# EAGLE design monitor-one-proto-card-v0.0.2 (EAGLE 9.6.2)
Assembly variants: proto-click
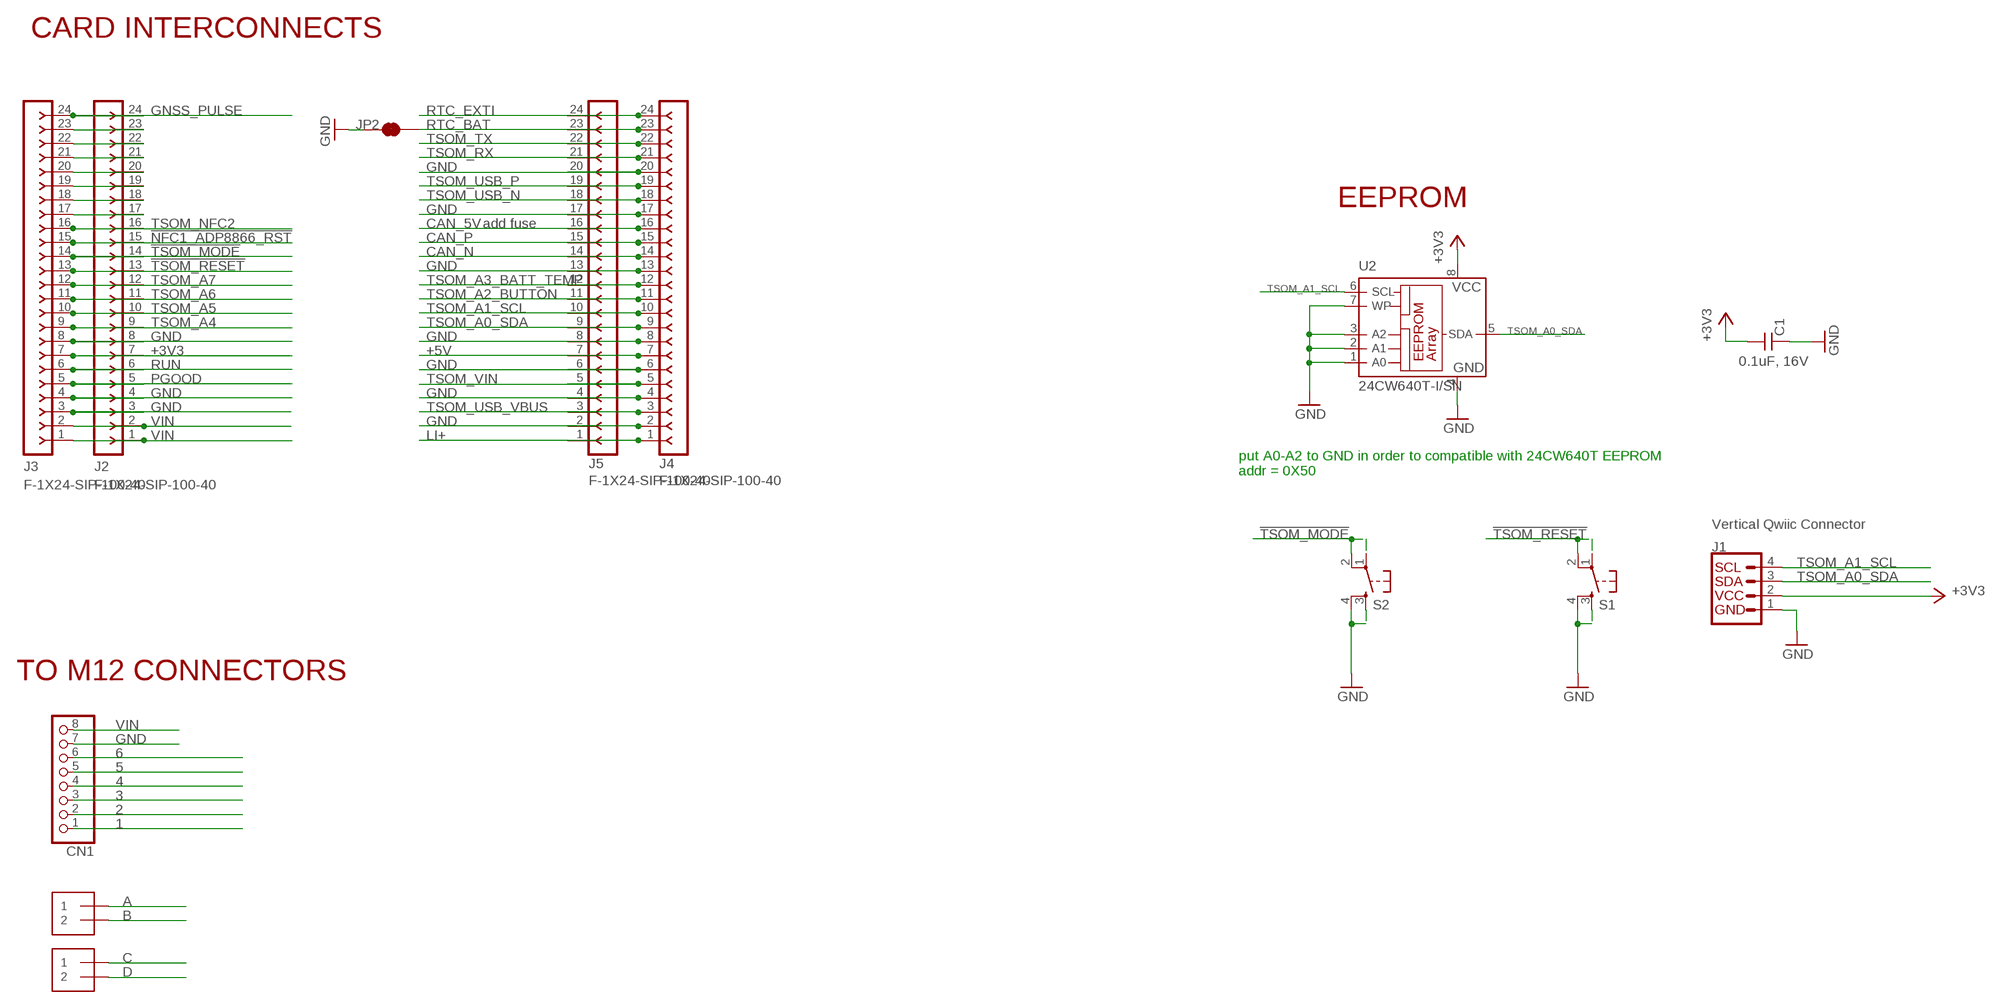
[diagram p0: schematic, sheet 1]

## Parts
C1  0.1uF, 16V  CAP_0.1UF_16V_0603  [C0603_P]  (not fitted in variant proto-click)
CN1  JST_8PIN  [JSTPH8]
J1  Vertical Qwiic Connector  QWIIC_CONNECTOR  [JST04_1MM_VERT]
J2  F-1X24-SIP-100-40  [SIP-100-24-40]
J3  F-1X24-SIP-100-40  [SIP-100-24-40]
J4  F-1X24-SIP-100-40  [SIP-100-24-40]
J5  F-1X24-SIP-100-40  [SIP-100-24-40]
J8  1X2-3.5MM  [1X2-3.5MM]
J9  1X2-3.5MM  [1X2-3.5MM]
JP2  JUMPER-SMT_2_NC_TRACE_NO-SILK  [SMT-JUMPER_2_NC_TRACE_NO-SILK]
S1  TAC_SWITCHSMD  [TACTILE_SWITCH_SMD]
S2  TAC_SWITCHSMD  [TACTILE_SWITCH_SMD]
U2  24CW640T-I/SN  24AA01SN  [SO-08]  (not fitted in variant proto-click)

## Nets
1: CN1.1
2: CN1.2
3: CN1.3
4: CN1.4
5: CN1.5
6: CN1.6
!NFC1_ADP8866_RST: J2.15 J3.15
!TSOM_MODE: J2.14 J3.14 S2.1 S2.2
!TSOM_RESET: J2.13 J3.13 S1.1 S1.2
+3V3: C1.1 J1.2 J2.7 J3.7 U2.8(VCC)
+5V: J4.7 J5.7
A: J8.1
B: J8.2
C: J9.1
CAN_5V: J4.16 J5.16
CAN_N: J4.14 J5.14
CAN_P: J4.15 J5.15
D: J9.2
GND: C1.2 CN1.7 J1.1 J2.3 J2.4 J2.8 J3.3 J3.4 J3.8 J4.2 J4.4 J4.6 J4.8 J4.13 J4.17 J4.20 J5.2 J5.4 J5.6 J5.8 J5.13 J5.17 J5.20 JP2.1 S1.3 S1.4 S2.3 S2.4 U2.1(A0) U2.2(A1) U2.3(A2) U2.4(GND) U2.7(WP)
GNSS_PULSE: J2.24 J3.24
LI+: J4.1 J5.1
N$3: J2.17 J3.17
N$4: J2.18 J3.18
N$5: J2.19 J3.19
N$6: J2.20 J3.20
N$7: J2.21 J3.21
N$8: J2.22 J3.22
N$9: J2.23 J3.23
PGOOD: J2.5 J3.5
RTC_BAT: J4.23 J5.23 JP2.2
RTC_EXTI: J4.24 J5.24
RUN: J2.6 J3.6
TSOM_A0_SDA: J1.3 J4.9 J5.9 U2.5(SDA)
TSOM_A1_SCL: J1.4 J4.10 J5.10 U2.6(SCL)
TSOM_A2_BUTTON: J4.11 J5.11
TSOM_A3_BATT_TEMP: J4.12 J5.12
TSOM_A4: J2.9 J3.9
TSOM_A5: J2.10 J3.10
TSOM_A6: J2.11 J3.11
TSOM_A7: J2.12 J3.12
TSOM_NFC2: J2.16 J3.16
TSOM_RX: J4.21 J5.21
TSOM_TX: J4.22 J5.22
TSOM_USB_N: J4.18 J5.18
TSOM_USB_P: J4.19 J5.19
TSOM_USB_VBUS: J4.3 J5.3
TSOM_VIN: J4.5 J5.5
VIN: CN1.8 J2.1 J2.2 J3.1 J3.2

## Notes on the sheet
- CARD INTERCONNECTS
- EEPROM
- add fuse
- put A0-A2 to GND in order to compatible with 24CW640T EEPROM
  addr = 0X50
- TO M12 CONNECTORS

## Library data of the parts
C1 = particle-studios:CAP_: Particle Capacitors; DESP: CAP CER 0.1UF 16V X7R 0603; MFG: FENGHUA; MPN: 0603B104K160NT; PPN: PT-200082
CN1 = microbuilder:JST_8PIN: JST 8-Pin Right-Angle Connector
J1 = SparkFun-Connectors:QWIIC_CONNECTOR: SparkFun I2C Standard Qwiic Connector An SMD 1mm pitch JST connector makes it easy and quick (get it? Qwiic?) to connect I2C devices to each other. The Qwiic system <http://www.sparkfun.com/qwiic> enables fast and solderless connection between popular platforms and various sensors and actuators. We carry 200mm <https://www.sparkfun.com/products/14204>, 100mm <https://www.sparkfun.com/products/14205>, 50mm <https://www.sparkfun.com/products/14206>, and breadboard friendly <https://www.sparkfun.com/products/14207> Qwiic cables. We also offer 10 pcs strips <https://www.sparkfun.com/products/14323> the SMD connectors.; PROD_ID: CONN-14483
J2-J5 = con-headers-jp:F-1X24-: FEMALE HEADER
J8 J9 = adafruit:1X2: 3.5mm Terminal block http://www.ladyada.net/library/pcb/eaglelibrary.html
JP2 = SparkFun-Jumpers:JUMPER-SMT_2_NC_TRACE: Normally closed trace jumper This jumper has a trace between two pads so it's normally closed (NC). Use a razor knife to open the connection. For best results follow the IPC guidelines for cutting traces: Cutout at least 0.063 mm (0.005 in). Remove all loose material to clean up the cut area. Seal the cut with an approved epoxy. Reapply solder to reclose the connection.
S1 S2 = particle-studios:TAC_SWITCH: SMD Tactiile Switch
U2 = microchip:24*: Serial EEPROM I2C; MF: MICROCHIP; MPN: 24AA01/SN; OC_FARNELL: 1331268; OC_NEWARK: 89C9792

## Net classes
1 USB: width 0.483 mm, clearance 0.152 mm
3 CAN: width 0.483 mm, clearance 0.152 mm

## Board
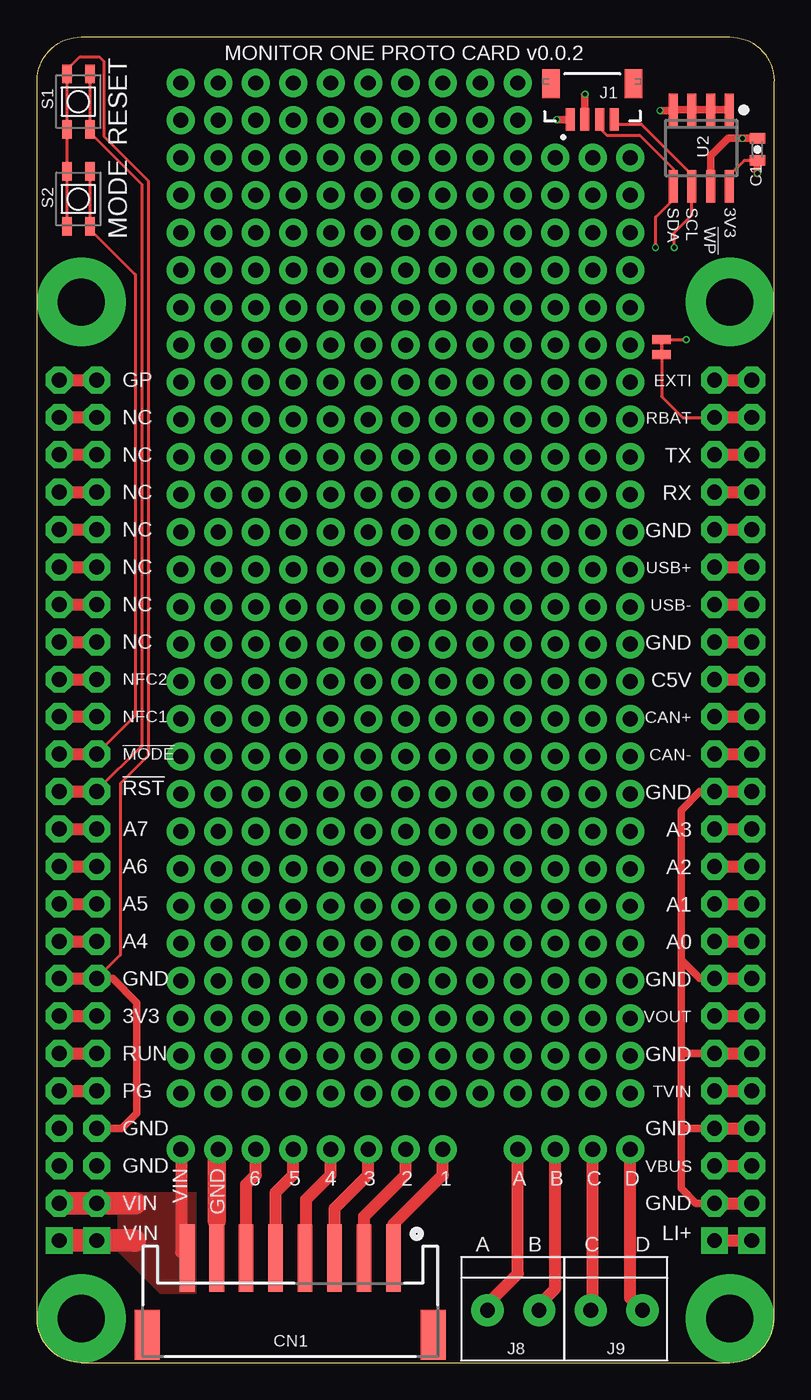
[diagram p1: board, top side]
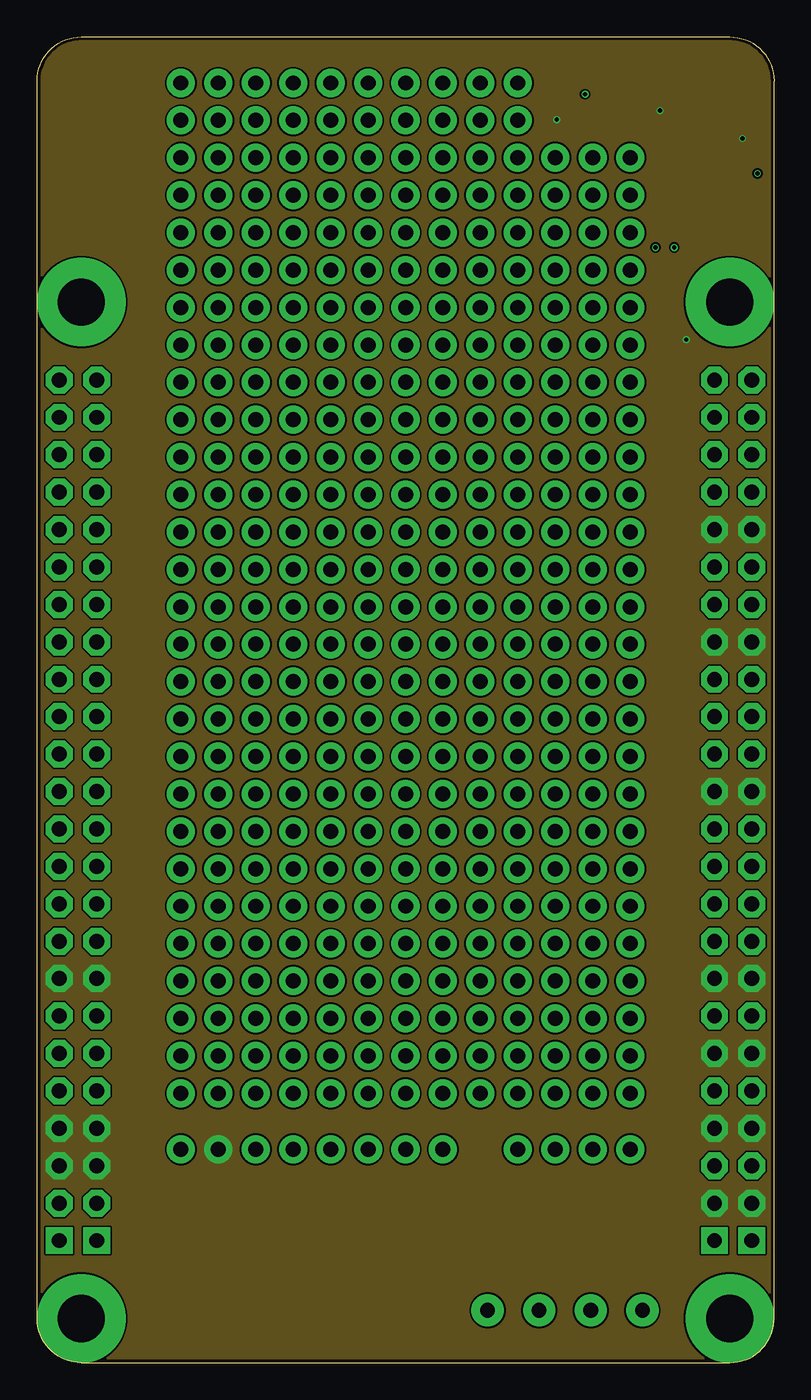
[diagram p2: board, inner layer Route2]
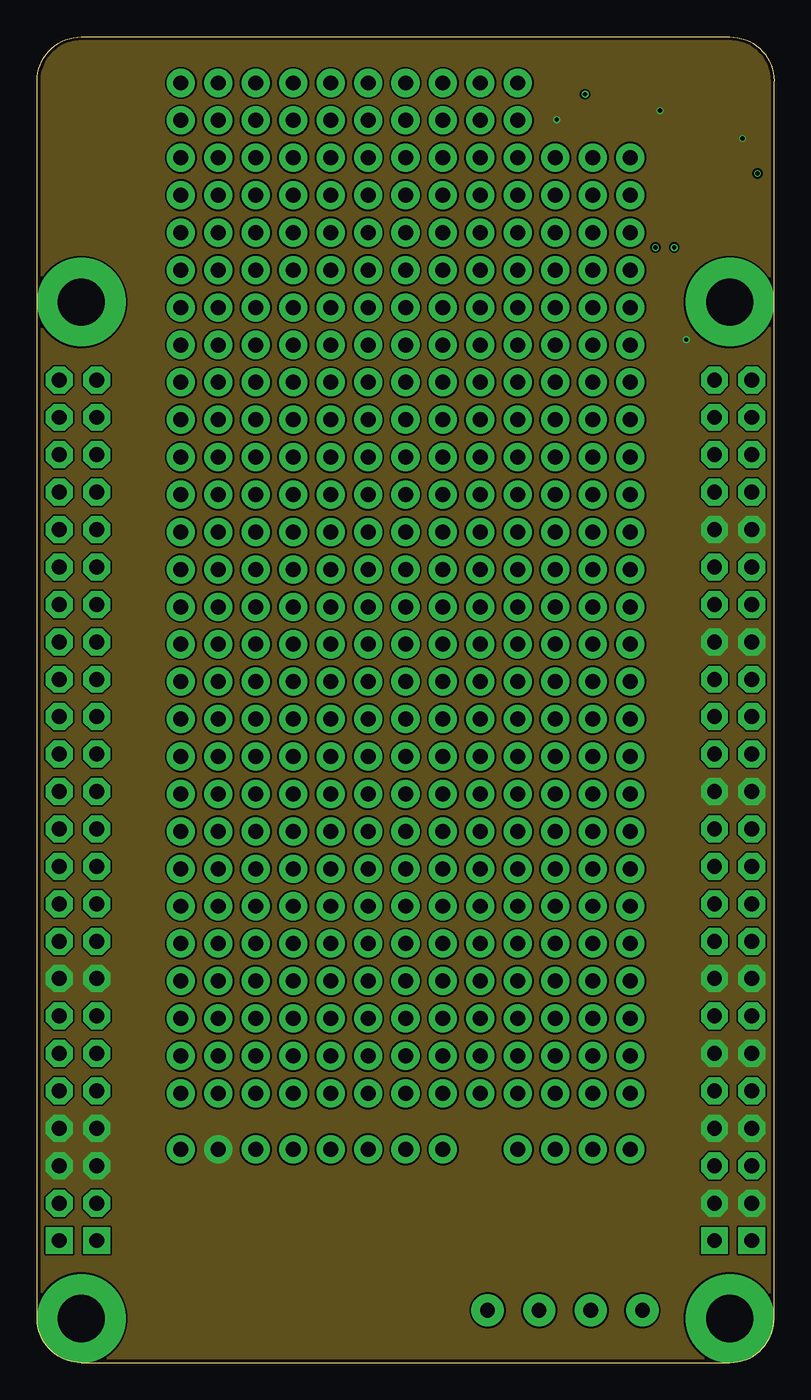
[diagram p3: board, inner layer Route15]
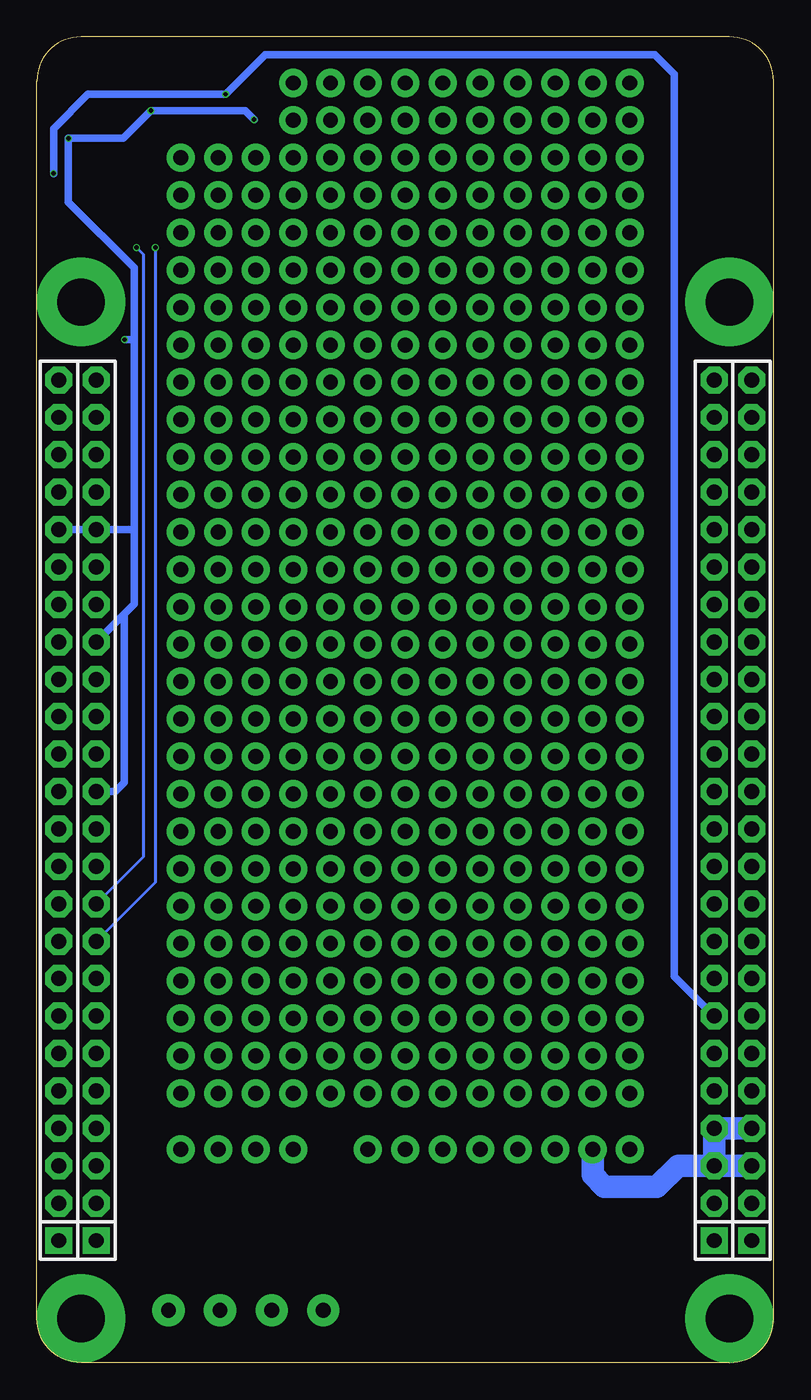
[diagram p4: board, bottom side, seen from below]

Size 50 x 90 mm. Coordinates in mm from the lower left corner, seen from the top.
Outline: 3,0 47,0 arc90 50,3 50,87 arc90 47,90 3,90 arc90 0,87 0,3 arc90 3,0
Copper layers (1*16): Top 0.035mm / dielectric 1.6mm / Bottom 0.035mm
Design rules "jlcpcb-2layers": minimum track width 5mil, minimum drill 0.3mm, track to track 5mil, track to pad 5mil, pad to pad 5mil, via to via 5mil, smd to smd 5mil, copper to edge 0.2mm, drill to drill 6mil, minimum pad ring 10mil, minimum via ring 3mil, stop-mask expansion 4mil, vias tented up to drill 0mil, thermal gap 10mil

### Footprints (pad centres in the part's own frame; a part is rotated, then mirrored left to right if it is on the bottom)
C0603_P = smd 0.711 x 1.041: 1 -0.749,0; 2 0.749,0
JSTPH8 = smd 1 x 4.6: 1 -7,-3.7; 2 -5,-3.7; 3 -3,-3.7; 4 -1,-3.7; 5 1,-3.7; 6 3,-3.7; 7 5,-3.7; 8 7,-3.7 | smd 1.7 x 3.4: NC1 -9.7,1.5; NC2 9.7,1.5
JST04_1MM_VERT = smd 0.6 x 1.55: 1 -1.478,0.775; 2 -0.478,0.775; 3 0.522,0.775; 4 1.522,0.775 | smd 1.2 x 2: NC1 -2.778,3.2; NC2 2.822,3.2
SIP-100-24-40 = drill 1.016 pad 1.778 square: 1 -29.21,0 | drill 1.016 pad 1.778 octagon: 2 -26.67,0; 3 -24.13,0; 4 -21.59,0; 5 -19.05,0; 6 -16.51,0; 7 -13.97,0; 8 -11.43,0; 9 -8.89,0; 10 -6.35,0; 11 -3.81,0; 12 -1.27,0; 13 1.27,0; 14 3.81,0; 15 6.35,0; 16 8.89,0; 17 11.43,0; 18 13.97,0; 19 16.51,0; 20 19.05,0; 21 21.59,0; 22 24.13,0; 23 26.67,0; 24 29.21,0
1X2-3.5MM = drill 1 pad 2.184: 1 1.8,0; 2 -1.7,0
SMT-JUMPER_2_NC_TRACE_NO-SILK = smd 0.635 x 1.27: 1 -0.508,0; 2 0.508,0
TACTILE_SWITCH_SMD = smd 1.25 x 0.65: 1 -1.875,0.775; 2 1.875,0.775; 3 -1.875,-0.775; 4 1.875,-0.775
SO-08 = smd 0.6 x 2.2: 1 -1.905,-2.6; 2 -0.635,-2.6; 3 0.635,-2.6; 4 1.905,-2.6; 5 1.905,2.6; 6 0.635,2.6; 7 -0.635,2.6; 8 -1.905,2.6

### Placement (x,y rotation side)
C1  48.87,82.35 90 top
CN1  17.18,3.4 180 top
J1  37.64,83.62 0 top
J2  1.5,37.5 90 bottom
J3  4.04,37.5 90 bottom
J4  45.96,37.5 90 bottom
J5  48.5,37.5 90 bottom
J8  32.36,3.56 180 top
J9  39.37,3.56 180 top
JP2  42.37,68.94 270 top
S1  2.79,85.6 270 top
S2  2.79,78.99 270 top
U2  45.06,82.45 180 top

### Tracks (layer width: path | path; a pad name or v marks a point on that pad's centre or on a via)
1  (via drill 1.02 pad 1.91)
  Top 0.813: CN1.1 24.18,9.39 27.53,12.75 v27.53,14.48
2  (via drill 1.02 pad 1.91)
  Top 0.813: CN1.2 22.18,9.93 24.99,12.75 v24.99,14.48
3  (via drill 1.02 pad 1.91)
  Top 0.813: CN1.3 20.18,10.47 22.45,12.75 v22.45,14.48
4  (via drill 1.02 pad 1.91)
  Top 0.813: CN1.4 18.23,7.15 18.23,11.06 19.91,12.75 v19.91,14.48
5  (via drill 1.02 pad 1.91)
  Top 0.813: CN1.5 16.18,11.55 17.37,12.75 v17.37,14.48
6  (via drill 1.02 pad 1.91)
  Top 0.813: CN1.6 14.18,12.09 14.83,12.75 v14.83,14.48
!NFC1_ADP8866_RST
  Top 0.813: J2.15 J3.15
!TSOM_MODE
  Top 0.203: S2.1 S2.2 3.57,76.95 6.66,73.86 6.66,43.92 J3.14
  Top 0.813: J2.14 J3.14
!TSOM_RESET
  Top 0.203: S1.1 S1.2 3.57,83.52 7.11,79.98 7.11,41.91 | 7.11,41.85 7.11,41.91 | 7.11,41.91 4.04,38.84 J3.13
  Top 0.813: J2.13 J3.13
+3V3  (via drill 0.3)
  Top 0.203: C1.1 47.97,81.6 46.97,80.59 46.97,80.47 | 46.97,80.47 U2.8 | 46.92,80.51 46.97,80.47
  Top 0.508: v48.87,80.72 C1.1 | J1.2 37.16,86.08 v37.19,86.11
  Top 0.813: J2.7 J3.7
  Bottom 0.508: v48.87,80.72 48.87,83.77 46.53,86.11 v37.19,86.11 34.49,88.8 8.08,88.8 6.76,87.48 6.76,26.21 4.07,23.53 J3.7
+5V
  Top 0.813: J4.7 J5.7
A  (via drill 1.02 pad 1.91)
  Top 0.813: J8.1 30.56,3.99 32.61,6.04 v32.61,14.48
B  (via drill 1.02 pad 1.91)
  Top 0.813: J8.2 34.06,3.94 35.15,5.03 v35.15,14.48
C  (via drill 1.02 pad 1.91)
  Top 0.813: J9.1 37.67,3.66 37.67,14.46 v37.69,14.48
CAN_5V
  Top 0.813: J4.16 J5.16
CAN_N
  Top 0.813: J4.14 J5.14
CAN_P
  Top 0.813: J4.15 J5.15
D  (via drill 1.02 pad 1.91)
  Top 0.813: J9.2 40.23,4.39 v40.23,14.48
GND  (via drill 0.3, 1.02 pad 1.91)
  Top 0.203: S2.4 S2.3 S1.4 S1.3 2.02,87.77 2.9,88.65 4.22,88.65 4.52,88.34 4.52,83.26 7.57,80.21 7.57,41.25 5.65,39.33 5.65,27.68 J3.8 | 43.16,84.35 U2.4 U2.3 U2.2 U2.1 | JP2.1 v44.04,69.44
  Top 0.508: J1.1 v35.26,84.38 | v42.27,84.99 43.09,84.99 U2.4 U2.1 | C1.2 48.86,83.11 v47.85,83.11 46.89,83.11 45.7,81.92 U2.7 | J4.8 44.95,26.07 43.69,27.33 | 43.69,27.33 43.69,37.49 44.97,38.77 J4.13 | 43.69,27.33 43.69,21.18 | 43.69,21.18 43.69,16 | 43.69,16 43.69,11.84 44.69,10.83 J4.2 | J4.4 43.78,15.91 43.69,16 | J4.6 43.88,20.99 43.69,21.18 | J3.8 5.12,26.07 6.76,24.43 6.76,16.92 5.75,15.91 J3.4
  Top 0.813: 12.19,9.65 12.19,7.12 CN1.7 | J2.8 J3.8 | J4.4 J5.4 | J4.2 J5.2 | J4.6 J5.6 | J4.8 J5.8 | J4.13 J5.13 | J4.17 J5.17 | J4.20 J5.20
  Top 1.27: v12.29,14.48 12.19,14.38 12.19,9.65
  Bottom 0.508: v35.26,84.38 35.87,84.99 v42.27,84.99 44.15,83.11 v47.85,83.11 47.85,78.79 43.38,74.32 43.38,69.44 | 44.07,50.82 43.38,51.51 43.38,56.44 | 44.07,50.82 J4.17 | 43.38,69.44 43.38,56.44 | v44.04,69.44 43.38,69.44 | 43.38,56.44 43.49,56.55 J5.20 | 44.07,50.82 44.07,39.4 44.69,38.77 J4.13
  Bottom 1.524: v12.29,14.48 12.29,12.75 11.48,11.94 7.92,11.94 6.49,13.37 J3.3 | J2.4 J3.4 J3.3 | J3.3 J2.3
  pour Route2 (no thermals): 0,0 0,90.17 52.07,90.17 52.07,0
  pour Route15 (no thermals): 0,0 53.34,0 53.34,90.17 0,90.17
GNSS_PULSE
  Top 0.813: J2.24 J3.24
LI+
  Top 0.813: J4.1 J5.1
N$2  (via drill 1.02 pad 1.91)
  other vias: 12.29,48.77
N$3
  Top 0.813: J2.17 J3.17
N$4
  Top 0.813: J2.18 J3.18
N$5
  Top 0.813: J2.19 J3.19
N$6
  Top 0.813: J2.20 J3.20
N$7
  Top 0.813: J2.21 J3.21
N$8
  Top 0.813: J2.22 J3.22
N$9
  Top 0.813: J2.23 J3.23
N$10  (via drill 1.02 pad 1.91)
  other vias: 12.29,51.31
N$12  (via drill 1.02 pad 1.91)
  other vias: 12.29,53.85
N$13  (via drill 1.02 pad 1.91)
  other vias: 12.29,56.39
N$14  (via drill 1.02 pad 1.91)
  other vias: 14.83,56.39
N$15  (via drill 1.02 pad 1.91)
  other vias: 12.29,79.25
N$16  (via drill 1.02 pad 1.91)
  other vias: 14.83,53.85
N$17  (via drill 1.02 pad 1.91)
  other vias: 12.29,81.79
N$18  (via drill 1.02 pad 1.91)
  other vias: 12.29,84.33
N$19  (via drill 1.02 pad 1.91)
  other vias: 12.29,86.87
N$20  (via drill 1.02 pad 1.91)
  other vias: 14.83,86.87
N$21  (via drill 3.2 pad 6)
  other vias: 3,3
N$22  (via drill 1.02 pad 1.91)
  other vias: 14.83,84.33
N$23  (via drill 3.2 pad 6)
  other vias: 47,3
N$24  (via drill 3.2 pad 6)
  other vias: 3,72
N$25  (via drill 1.02 pad 1.91)
  other vias: 14.83,81.79
N$26  (via drill 1.02 pad 1.91)
  other vias: 14.83,79.25
N$27  (via drill 3.2 pad 6)
  other vias: 47,72
N$28  (via drill 1.02 pad 1.91)
  other vias: 14.83,51.31
N$29  (via drill 1.02 pad 1.91)
  other vias: 14.83,48.77
N$30  (via drill 1.02 pad 1.91)
  other vias: 17.37,79.25
N$31  (via drill 1.02 pad 1.91)
  other vias: 17.37,81.79
N$32  (via drill 1.02 pad 1.91)
  other vias: 17.37,84.33
N$33  (via drill 1.02 pad 1.91)
  other vias: 17.37,86.87
N$34  (via drill 1.02 pad 1.91)
  other vias: 19.91,86.87
N$35  (via drill 1.02 pad 1.91)
  other vias: 19.91,84.33
N$36  (via drill 1.02 pad 1.91)
  other vias: 19.91,81.79
N$37  (via drill 1.02 pad 1.91)
  other vias: 19.91,79.25
N$38  (via drill 1.02 pad 1.91)
  other vias: 17.37,48.77
N$39  (via drill 1.02 pad 1.91)
  other vias: 17.37,51.31
N$40  (via drill 1.02 pad 1.91)
  other vias: 22.45,79.25
N$41  (via drill 1.02 pad 1.91)
  other vias: 22.45,81.79
N$42  (via drill 1.02 pad 1.91)
  other vias: 22.45,84.33
N$43  (via drill 1.02 pad 1.91)
  other vias: 22.45,86.87
N$44  (via drill 1.02 pad 1.91)
  other vias: 24.99,86.87
N$45  (via drill 1.02 pad 1.91)
  other vias: 24.99,84.33
N$46  (via drill 1.02 pad 1.91)
  other vias: 24.99,81.79
N$47  (via drill 1.02 pad 1.91)
  other vias: 17.37,53.85
N$48  (via drill 1.02 pad 1.91)
  other vias: 24.99,79.25
N$49  (via drill 1.02 pad 1.91)
  other vias: 17.37,56.39
N$50  (via drill 1.02 pad 1.91)
  other vias: 12.29,64.01
N$51  (via drill 1.02 pad 1.91)
  other vias: 27.53,79.25
N$52  (via drill 1.02 pad 1.91)
  other vias: 27.53,81.79
N$53  (via drill 1.02 pad 1.91)
  other vias: 27.53,84.33
N$54  (via drill 1.02 pad 1.91)
  other vias: 27.53,86.87
N$55  (via drill 1.02 pad 1.91)
  other vias: 30.07,86.87
N$56  (via drill 1.02 pad 1.91)
  other vias: 30.07,84.33
N$57  (via drill 1.02 pad 1.91)
  other vias: 30.07,81.79
N$58  (via drill 1.02 pad 1.91)
  other vias: 30.07,79.25
N$59  (via drill 1.02 pad 1.91)
  other vias: 19.91,56.39
N$60  (via drill 1.02 pad 1.91)
  other vias: 32.61,86.87
N$61  (via drill 1.02 pad 1.91)
  other vias: 35.15,81.79
N$62  (via drill 1.02 pad 1.91)
  other vias: 35.15,79.25
N$65  (via drill 1.02 pad 1.91)
  other vias: 37.69,81.79
N$66  (via drill 1.02 pad 1.91)
  other vias: 37.69,79.25
N$69  (via drill 1.02 pad 1.91)
  other vias: 32.61,84.33
N$70  (via drill 1.02 pad 1.91)
  other vias: 32.61,81.79
N$71  (via drill 1.02 pad 1.91)
  other vias: 32.61,79.25
N$72  (via drill 1.02 pad 1.91)
  other vias: 19.91,53.85
N$73  (via drill 1.02 pad 1.91)
  other vias: 14.83,64.01
N$74  (via drill 1.02 pad 1.91)
  other vias: 19.91,51.31
N$75  (via drill 1.02 pad 1.91)
  other vias: 19.91,48.77
N$76  (via drill 1.02 pad 1.91)
  other vias: 22.45,48.77
N$77  (via drill 1.02 pad 1.91)
  other vias: 22.45,51.31
N$78  (via drill 1.02 pad 1.91)
  other vias: 22.45,53.85
N$79  (via drill 1.02 pad 1.91)
  other vias: 12.29,76.71
N$80  (via drill 1.02 pad 1.91)
  other vias: 14.83,76.71
N$81  (via drill 1.02 pad 1.91)
  other vias: 17.37,76.71
N$82  (via drill 1.02 pad 1.91)
  other vias: 19.91,76.71
N$83  (via drill 1.02 pad 1.91)
  other vias: 22.45,76.71
N$84  (via drill 1.02 pad 1.91)
  other vias: 24.99,76.71
N$85  (via drill 1.02 pad 1.91)
  other vias: 27.53,76.71
N$86  (via drill 1.02 pad 1.91)
  other vias: 30.07,76.71
N$87  (via drill 1.02 pad 1.91)
  other vias: 37.69,76.71
N$88  (via drill 1.02 pad 1.91)
  other vias: 35.15,76.71
N$89  (via drill 1.02 pad 1.91)
  other vias: 32.61,76.71
N$90  (via drill 1.02 pad 1.91)
  other vias: 12.29,74.17
N$91  (via drill 1.02 pad 1.91)
  other vias: 14.83,74.17
N$92  (via drill 1.02 pad 1.91)
  other vias: 17.37,74.17
N$93  (via drill 1.02 pad 1.91)
  other vias: 19.91,74.17
N$94  (via drill 1.02 pad 1.91)
  other vias: 22.45,74.17
N$95  (via drill 1.02 pad 1.91)
  other vias: 24.99,74.17
N$96  (via drill 1.02 pad 1.91)
  other vias: 27.53,74.17
N$97  (via drill 1.02 pad 1.91)
  other vias: 30.07,74.17
N$98  (via drill 1.02 pad 1.91)
  other vias: 37.69,74.17
N$99  (via drill 1.02 pad 1.91)
  other vias: 35.15,74.17
N$100  (via drill 1.02 pad 1.91)
  other vias: 32.61,74.17
N$101  (via drill 1.02 pad 1.91)
  other vias: 12.29,71.63
N$102  (via drill 1.02 pad 1.91)
  other vias: 14.83,71.63
N$103  (via drill 1.02 pad 1.91)
  other vias: 17.37,71.63
N$104  (via drill 1.02 pad 1.91)
  other vias: 19.91,71.63
N$105  (via drill 1.02 pad 1.91)
  other vias: 22.45,71.63
N$106  (via drill 1.02 pad 1.91)
  other vias: 24.99,71.63
N$107  (via drill 1.02 pad 1.91)
  other vias: 27.53,71.63
N$108  (via drill 1.02 pad 1.91)
  other vias: 30.07,71.63
N$109  (via drill 1.02 pad 1.91)
  other vias: 37.69,71.63
N$110  (via drill 1.02 pad 1.91)
  other vias: 35.15,71.63
N$111  (via drill 1.02 pad 1.91)
  other vias: 32.61,71.63
N$112  (via drill 1.02 pad 1.91)
  other vias: 12.29,69.09
N$113  (via drill 1.02 pad 1.91)
  other vias: 14.83,69.09
N$114  (via drill 1.02 pad 1.91)
  other vias: 17.37,69.09
N$115  (via drill 1.02 pad 1.91)
  other vias: 19.91,69.09
N$116  (via drill 1.02 pad 1.91)
  other vias: 22.45,69.09
N$117  (via drill 1.02 pad 1.91)
  other vias: 24.99,69.09
N$118  (via drill 1.02 pad 1.91)
  other vias: 27.53,69.09
N$119  (via drill 1.02 pad 1.91)
  other vias: 30.07,69.09
N$120  (via drill 1.02 pad 1.91)
  other vias: 37.69,69.09
N$121  (via drill 1.02 pad 1.91)
  other vias: 35.15,69.09
N$122  (via drill 1.02 pad 1.91)
  other vias: 32.61,69.09
N$123  (via drill 1.02 pad 1.91)
  other vias: 12.29,66.55
N$124  (via drill 1.02 pad 1.91)
  other vias: 14.83,66.55
N$125  (via drill 1.02 pad 1.91)
  other vias: 17.37,66.55
N$126  (via drill 1.02 pad 1.91)
  other vias: 19.91,66.55
N$127  (via drill 1.02 pad 1.91)
  other vias: 22.45,66.55
N$128  (via drill 1.02 pad 1.91)
  other vias: 24.99,66.55
N$129  (via drill 1.02 pad 1.91)
  other vias: 27.53,66.55
N$130  (via drill 1.02 pad 1.91)
  other vias: 30.07,66.55
N$131  (via drill 1.02 pad 1.91)
  other vias: 37.69,66.55
N$132  (via drill 1.02 pad 1.91)
  other vias: 35.15,66.55
N$133  (via drill 1.02 pad 1.91)
  other vias: 32.61,66.55
N$134  (via drill 1.02 pad 1.91)
  other vias: 22.45,56.39
N$135  (via drill 1.02 pad 1.91)
  other vias: 17.37,64.01
N$136  (via drill 1.02 pad 1.91)
  other vias: 24.99,56.39
N$137  (via drill 1.02 pad 1.91)
  other vias: 24.99,53.85
N$138  (via drill 1.02 pad 1.91)
  other vias: 19.91,64.01
N$139  (via drill 1.02 pad 1.91)
  other vias: 22.45,64.01
N$140  (via drill 1.02 pad 1.91)
  other vias: 24.99,64.01
N$141  (via drill 1.02 pad 1.91)
  other vias: 27.53,64.01
N$142  (via drill 1.02 pad 1.91)
  other vias: 30.07,64.01
N$143  (via drill 1.02 pad 1.91)
  other vias: 37.69,64.01
N$144  (via drill 1.02 pad 1.91)
  other vias: 35.15,64.01
N$145  (via drill 1.02 pad 1.91)
  other vias: 32.61,64.01
N$146  (via drill 1.02 pad 1.91)
  other vias: 12.29,61.47
N$147  (via drill 1.02 pad 1.91)
  other vias: 14.83,61.47
N$148  (via drill 1.02 pad 1.91)
  other vias: 17.37,61.47
N$149  (via drill 1.02 pad 1.91)
  other vias: 19.91,61.47
N$150  (via drill 1.02 pad 1.91)
  other vias: 22.45,61.47
N$151  (via drill 1.02 pad 1.91)
  other vias: 24.99,61.47
N$152  (via drill 1.02 pad 1.91)
  other vias: 27.53,61.47
N$153  (via drill 1.02 pad 1.91)
  other vias: 30.07,61.47
N$154  (via drill 1.02 pad 1.91)
  other vias: 37.69,61.47
N$155  (via drill 1.02 pad 1.91)
  other vias: 35.15,61.47
N$156  (via drill 1.02 pad 1.91)
  other vias: 32.61,61.47
N$157  (via drill 1.02 pad 1.91)
  other vias: 12.29,58.93
N$158  (via drill 1.02 pad 1.91)
  other vias: 14.83,58.93
N$159  (via drill 1.02 pad 1.91)
  other vias: 17.37,58.93
N$160  (via drill 1.02 pad 1.91)
  other vias: 19.91,58.93
N$161  (via drill 1.02 pad 1.91)
  other vias: 22.45,58.93
N$162  (via drill 1.02 pad 1.91)
  other vias: 24.99,58.93
N$163  (via drill 1.02 pad 1.91)
  other vias: 27.53,58.93
N$164  (via drill 1.02 pad 1.91)
  other vias: 30.07,58.93
N$165  (via drill 1.02 pad 1.91)
  other vias: 37.69,58.93
N$166  (via drill 1.02 pad 1.91)
  other vias: 35.15,58.93
N$167  (via drill 1.02 pad 1.91)
  other vias: 32.61,58.93
N$168  (via drill 1.02 pad 1.91)
  other vias: 24.99,51.31
N$169  (via drill 1.02 pad 1.91)
  other vias: 24.99,48.77
N$170  (via drill 1.02 pad 1.91)
  other vias: 27.53,48.77
N$171  (via drill 1.02 pad 1.91)
  other vias: 27.53,51.31
N$172  (via drill 1.02 pad 1.91)
  other vias: 27.53,53.85
N$173  (via drill 1.02 pad 1.91)
  other vias: 27.53,56.39
N$174  (via drill 1.02 pad 1.91)
  other vias: 30.07,56.39
N$175  (via drill 1.02 pad 1.91)
  other vias: 30.07,53.85
N$176  (via drill 1.02 pad 1.91)
  other vias: 30.07,51.31
N$177  (via drill 1.02 pad 1.91)
  other vias: 30.07,48.77
N$178  (via drill 1.02 pad 1.91)
  other vias: 32.61,56.39
N$179  (via drill 1.02 pad 1.91)
  other vias: 35.15,56.39
N$180  (via drill 1.02 pad 1.91)
  other vias: 37.69,56.39
N$181  (via drill 1.02 pad 1.91)
  other vias: 37.69,53.85
N$182  (via drill 1.02 pad 1.91)
  other vias: 37.69,51.31
N$183  (via drill 1.02 pad 1.91)
  other vias: 37.69,48.77
N$184  (via drill 1.02 pad 1.91)
  other vias: 35.15,48.77
N$185  (via drill 1.02 pad 1.91)
  other vias: 35.15,51.31
N$186  (via drill 1.02 pad 1.91)
  other vias: 35.15,53.85
N$187  (via drill 1.02 pad 1.91)
  other vias: 32.61,53.85
N$188  (via drill 1.02 pad 1.91)
  other vias: 32.61,51.31
N$189  (via drill 1.02 pad 1.91)
  other vias: 32.61,48.77
N$190  (via drill 1.02 pad 1.91)
  other vias: 12.29,46.23
N$191  (via drill 1.02 pad 1.91)
  other vias: 14.83,46.23
N$192  (via drill 1.02 pad 1.91)
  other vias: 17.37,46.23
N$193  (via drill 1.02 pad 1.91)
  other vias: 19.91,46.23
N$194  (via drill 1.02 pad 1.91)
  other vias: 22.45,46.23
N$195  (via drill 1.02 pad 1.91)
  other vias: 24.99,46.23
N$196  (via drill 1.02 pad 1.91)
  other vias: 27.53,46.23
N$197  (via drill 1.02 pad 1.91)
  other vias: 30.07,46.23
N$198  (via drill 1.02 pad 1.91)
  other vias: 37.69,46.23
N$199  (via drill 1.02 pad 1.91)
  other vias: 35.15,46.23
N$200  (via drill 1.02 pad 1.91)
  other vias: 32.61,46.23
N$201  (via drill 1.02 pad 1.91)
  other vias: 12.29,43.69
N$202  (via drill 1.02 pad 1.91)
  other vias: 14.83,43.69
N$203  (via drill 1.02 pad 1.91)
  other vias: 17.37,43.69
N$204  (via drill 1.02 pad 1.91)
  other vias: 19.91,43.69
N$205  (via drill 1.02 pad 1.91)
  other vias: 22.45,43.69
N$206  (via drill 1.02 pad 1.91)
  other vias: 24.99,43.69
N$207  (via drill 1.02 pad 1.91)
  other vias: 27.53,43.69
N$208  (via drill 1.02 pad 1.91)
  other vias: 30.07,43.69
N$209  (via drill 1.02 pad 1.91)
  other vias: 37.69,43.69
N$210  (via drill 1.02 pad 1.91)
  other vias: 35.15,43.69
N$211  (via drill 1.02 pad 1.91)
  other vias: 32.61,43.69
N$212  (via drill 1.02 pad 1.91)
  other vias: 12.29,41.15
N$213  (via drill 1.02 pad 1.91)
  other vias: 14.83,41.15
N$214  (via drill 1.02 pad 1.91)
  other vias: 17.37,41.15
N$215  (via drill 1.02 pad 1.91)
  other vias: 19.91,41.15
N$216  (via drill 1.02 pad 1.91)
  other vias: 22.45,41.15
N$217  (via drill 1.02 pad 1.91)
  other vias: 24.99,41.15
N$218  (via drill 1.02 pad 1.91)
  other vias: 27.53,41.15
N$219  (via drill 1.02 pad 1.91)
  other vias: 30.07,41.15
N$220  (via drill 1.02 pad 1.91)
  other vias: 37.69,41.15
N$221  (via drill 1.02 pad 1.91)
  other vias: 35.15,41.15
N$222  (via drill 1.02 pad 1.91)
  other vias: 32.61,41.15
N$223  (via drill 1.02 pad 1.91)
  other vias: 12.29,38.61
N$224  (via drill 1.02 pad 1.91)
  other vias: 14.83,38.61
N$225  (via drill 1.02 pad 1.91)
  other vias: 17.37,38.61
N$226  (via drill 1.02 pad 1.91)
  other vias: 19.91,38.61
N$227  (via drill 1.02 pad 1.91)
  other vias: 22.45,38.61
N$228  (via drill 1.02 pad 1.91)
  other vias: 24.99,38.61
N$229  (via drill 1.02 pad 1.91)
  other vias: 27.53,38.61
N$230  (via drill 1.02 pad 1.91)
  other vias: 30.07,38.61
N$231  (via drill 1.02 pad 1.91)
  other vias: 37.69,38.61
N$232  (via drill 1.02 pad 1.91)
  other vias: 35.15,38.61
N$233  (via drill 1.02 pad 1.91)
  other vias: 32.61,38.61
N$234  (via drill 1.02 pad 1.91)
  other vias: 12.29,36.07
N$235  (via drill 1.02 pad 1.91)
  other vias: 14.83,36.07
N$236  (via drill 1.02 pad 1.91)
  other vias: 17.37,36.07
N$237  (via drill 1.02 pad 1.91)
  other vias: 19.91,36.07
N$238  (via drill 1.02 pad 1.91)
  other vias: 22.45,36.07
N$239  (via drill 1.02 pad 1.91)
  other vias: 24.99,36.07
N$240  (via drill 1.02 pad 1.91)
  other vias: 27.53,36.07
N$241  (via drill 1.02 pad 1.91)
  other vias: 30.07,36.07
N$242  (via drill 1.02 pad 1.91)
  other vias: 37.69,36.07
N$243  (via drill 1.02 pad 1.91)
  other vias: 35.15,36.07
N$244  (via drill 1.02 pad 1.91)
  other vias: 32.61,36.07
N$245  (via drill 1.02 pad 1.91)
  other vias: 12.29,33.53
N$246  (via drill 1.02 pad 1.91)
  other vias: 14.83,33.53
N$247  (via drill 1.02 pad 1.91)
  other vias: 17.37,33.53
N$248  (via drill 1.02 pad 1.91)
  other vias: 19.91,33.53
N$249  (via drill 1.02 pad 1.91)
  other vias: 22.45,33.53
N$250  (via drill 1.02 pad 1.91)
  other vias: 24.99,33.53
N$251  (via drill 1.02 pad 1.91)
  other vias: 27.53,33.53
N$252  (via drill 1.02 pad 1.91)
  other vias: 30.07,33.53
N$253  (via drill 1.02 pad 1.91)
  other vias: 37.69,33.53
N$254  (via drill 1.02 pad 1.91)
  other vias: 35.15,33.53
N$255  (via drill 1.02 pad 1.91)
  other vias: 32.61,33.53
N$256  (via drill 1.02 pad 1.91)
  other vias: 12.29,30.99
N$257  (via drill 1.02 pad 1.91)
  other vias: 14.83,30.99
N$258  (via drill 1.02 pad 1.91)
  other vias: 17.37,30.99
N$259  (via drill 1.02 pad 1.91)
  other vias: 19.91,30.99
N$260  (via drill 1.02 pad 1.91)
  other vias: 22.45,30.99
N$261  (via drill 1.02 pad 1.91)
  other vias: 24.99,30.99
N$262  (via drill 1.02 pad 1.91)
  other vias: 27.53,30.99
N$263  (via drill 1.02 pad 1.91)
  other vias: 30.07,30.99
N$264  (via drill 1.02 pad 1.91)
  other vias: 37.69,30.99
N$265  (via drill 1.02 pad 1.91)
  other vias: 35.15,30.99
N$266  (via drill 1.02 pad 1.91)
  other vias: 32.61,30.99
N$267  (via drill 1.02 pad 1.91)
  other vias: 12.29,28.45
N$268  (via drill 1.02 pad 1.91)
  other vias: 14.83,28.45
N$269  (via drill 1.02 pad 1.91)
  other vias: 17.37,28.45
N$270  (via drill 1.02 pad 1.91)
  other vias: 19.91,28.45
N$271  (via drill 1.02 pad 1.91)
  other vias: 22.45,28.45
N$272  (via drill 1.02 pad 1.91)
  other vias: 24.99,28.45
N$273  (via drill 1.02 pad 1.91)
  other vias: 27.53,28.45
N$274  (via drill 1.02 pad 1.91)
  other vias: 30.07,28.45
N$275  (via drill 1.02 pad 1.91)
  other vias: 37.69,28.45
N$276  (via drill 1.02 pad 1.91)
  other vias: 35.15,28.45
N$277  (via drill 1.02 pad 1.91)
  other vias: 32.61,28.45
N$278  (via drill 1.02 pad 1.91)
  other vias: 12.29,25.91
N$279  (via drill 1.02 pad 1.91)
  other vias: 14.83,25.91
N$280  (via drill 1.02 pad 1.91)
  other vias: 17.37,25.91
N$281  (via drill 1.02 pad 1.91)
  other vias: 19.91,25.91
N$282  (via drill 1.02 pad 1.91)
  other vias: 22.45,25.91
N$283  (via drill 1.02 pad 1.91)
  other vias: 24.99,25.91
N$284  (via drill 1.02 pad 1.91)
  other vias: 27.53,25.91
N$285  (via drill 1.02 pad 1.91)
  other vias: 30.07,25.91
N$286  (via drill 1.02 pad 1.91)
  other vias: 37.69,25.91
N$287  (via drill 1.02 pad 1.91)
  other vias: 35.15,25.91
N$288  (via drill 1.02 pad 1.91)
  other vias: 32.61,25.91
N$289  (via drill 1.02 pad 1.91)
  other vias: 12.29,23.37
N$290  (via drill 1.02 pad 1.91)
  other vias: 14.83,23.37
N$291  (via drill 1.02 pad 1.91)
  other vias: 17.37,23.37
N$292  (via drill 1.02 pad 1.91)
  other vias: 19.91,23.37
N$293  (via drill 1.02 pad 1.91)
  other vias: 22.45,23.37
N$294  (via drill 1.02 pad 1.91)
  other vias: 24.99,23.37
N$295  (via drill 1.02 pad 1.91)
  other vias: 27.53,23.37
N$296  (via drill 1.02 pad 1.91)
  other vias: 30.07,23.37
N$297  (via drill 1.02 pad 1.91)
  other vias: 40.23,23.37
N$298  (via drill 1.02 pad 1.91)
  other vias: 35.15,23.37
N$299  (via drill 1.02 pad 1.91)
  other vias: 32.61,23.37
N$300  (via drill 1.02 pad 1.91)
  other vias: 12.29,20.83
N$301  (via drill 1.02 pad 1.91)
  other vias: 14.83,20.83
N$302  (via drill 1.02 pad 1.91)
  other vias: 17.37,20.83
N$303  (via drill 1.02 pad 1.91)
  other vias: 19.91,20.83
N$304  (via drill 1.02 pad 1.91)
  other vias: 22.45,20.83
N$305  (via drill 1.02 pad 1.91)
  other vias: 24.99,20.83
N$306  (via drill 1.02 pad 1.91)
  other vias: 27.53,20.83
N$307  (via drill 1.02 pad 1.91)
  other vias: 30.07,20.83
N$308  (via drill 1.02 pad 1.91)
  other vias: 37.69,23.37
N$309  (via drill 1.02 pad 1.91)
  other vias: 35.15,20.83
N$310  (via drill 1.02 pad 1.91)
  other vias: 32.61,20.83
N$311  (via drill 1.02 pad 1.91)
  other vias: 12.29,18.29
N$312  (via drill 1.02 pad 1.91)
  other vias: 14.83,18.29
N$313  (via drill 1.02 pad 1.91)
  other vias: 17.37,18.29
N$314  (via drill 1.02 pad 1.91)
  other vias: 19.91,18.29
N$315  (via drill 1.02 pad 1.91)
  other vias: 22.45,18.29
N$316  (via drill 1.02 pad 1.91)
  other vias: 24.99,18.29
N$317  (via drill 1.02 pad 1.91)
  other vias: 27.53,18.29
N$318  (via drill 1.02 pad 1.91)
  other vias: 30.07,18.29
N$319  (via drill 1.02 pad 1.91)
  other vias: 40.23,20.83
N$320  (via drill 1.02 pad 1.91)
  other vias: 35.15,18.29
N$321  (via drill 1.02 pad 1.91)
  other vias: 32.61,18.29
N$322  (via drill 1.02 pad 1.91)
  other vias: 9.75,79.25
N$323  (via drill 1.02 pad 1.91)
  other vias: 9.75,81.79
N$324  (via drill 1.02 pad 1.91)
  other vias: 9.75,84.33
N$325  (via drill 1.02 pad 1.91)
  other vias: 9.75,86.87
N$326  (via drill 1.02 pad 1.91)
  other vias: 9.75,76.71
N$327  (via drill 1.02 pad 1.91)
  other vias: 9.75,74.17
N$328  (via drill 1.02 pad 1.91)
  other vias: 9.75,71.63
N$329  (via drill 1.02 pad 1.91)
  other vias: 9.75,69.09
N$330  (via drill 1.02 pad 1.91)
  other vias: 9.75,66.55
N$331  (via drill 1.02 pad 1.91)
  other vias: 9.75,64.01
N$332  (via drill 1.02 pad 1.91)
  other vias: 9.75,61.47
N$333  (via drill 1.02 pad 1.91)
  other vias: 9.75,58.93
N$334  (via drill 1.02 pad 1.91)
  other vias: 9.75,48.77
N$335  (via drill 1.02 pad 1.91)
  other vias: 9.75,51.31
N$336  (via drill 1.02 pad 1.91)
  other vias: 9.75,53.85
N$337  (via drill 1.02 pad 1.91)
  other vias: 9.75,56.39
N$338  (via drill 1.02 pad 1.91)
  other vias: 9.75,46.23
N$339  (via drill 1.02 pad 1.91)
  other vias: 9.75,43.69
N$340  (via drill 1.02 pad 1.91)
  other vias: 9.75,41.15
N$341  (via drill 1.02 pad 1.91)
  other vias: 9.75,38.61
N$342  (via drill 1.02 pad 1.91)
  other vias: 9.75,36.07
N$343  (via drill 1.02 pad 1.91)
  other vias: 9.75,33.53
N$344  (via drill 1.02 pad 1.91)
  other vias: 9.75,30.99
N$345  (via drill 1.02 pad 1.91)
  other vias: 9.75,28.45
N$346  (via drill 1.02 pad 1.91)
  other vias: 9.75,25.91
N$347  (via drill 1.02 pad 1.91)
  other vias: 9.75,23.37
N$348  (via drill 1.02 pad 1.91)
  other vias: 9.75,20.83
N$349  (via drill 1.02 pad 1.91)
  other vias: 9.75,18.29
N$350  (via drill 1.02 pad 1.91)
  other vias: 40.23,81.79
N$351  (via drill 1.02 pad 1.91)
  other vias: 40.23,79.25
N$352  (via drill 1.02 pad 1.91)
  other vias: 37.69,20.83
N$353  (via drill 1.02 pad 1.91)
  other vias: 40.23,18.29
N$354  (via drill 1.02 pad 1.91)
  other vias: 40.23,76.71
N$355  (via drill 1.02 pad 1.91)
  other vias: 40.23,74.17
N$356  (via drill 1.02 pad 1.91)
  other vias: 40.23,71.63
N$357  (via drill 1.02 pad 1.91)
  other vias: 40.23,69.09
N$358  (via drill 1.02 pad 1.91)
  other vias: 40.23,66.55
N$359  (via drill 1.02 pad 1.91)
  other vias: 40.23,64.01
N$360  (via drill 1.02 pad 1.91)
  other vias: 40.23,61.47
N$361  (via drill 1.02 pad 1.91)
  other vias: 40.23,58.93
N$362  (via drill 1.02 pad 1.91)
  other vias: 40.23,48.77
N$363  (via drill 1.02 pad 1.91)
  other vias: 40.23,51.31
N$364  (via drill 1.02 pad 1.91)
  other vias: 40.23,53.85
N$365  (via drill 1.02 pad 1.91)
  other vias: 40.23,56.39
N$366  (via drill 1.02 pad 1.91)
  other vias: 40.23,46.23
N$367  (via drill 1.02 pad 1.91)
  other vias: 40.23,43.69
N$368  (via drill 1.02 pad 1.91)
  other vias: 40.23,41.15
N$369  (via drill 1.02 pad 1.91)
  other vias: 40.23,38.61
N$370  (via drill 1.02 pad 1.91)
  other vias: 40.23,36.07
N$371  (via drill 1.02 pad 1.91)
  other vias: 40.23,33.53
N$372  (via drill 1.02 pad 1.91)
  other vias: 40.23,30.99
N$373  (via drill 1.02 pad 1.91)
  other vias: 40.23,28.45
N$374  (via drill 1.02 pad 1.91)
  other vias: 40.23,25.91
N$375  (via drill 1.02 pad 1.91)
  other vias: 37.69,18.29
PGOOD
  Top 0.813: J2.5 J3.5
RTC_BAT
  Top 0.203: JP2.2 42.37,65.58 43.79,64.16 J4.23
  Top 0.813: J4.23 J5.23
RTC_EXTI
  Top 0.813: J4.24 J5.24
RUN
  Top 0.813: J2.6 J3.6
TSOM_A0_SDA  (via drill 0.3)
  Top 0.203: v41.96,75.69 41.96,77.78 43.18,78.99 43.18,79.82 U2.5 43.16,81.05 40.89,83.31 38.66,83.31 38.16,83.81 J1.3
  Top 0.813: J4.9 J5.9
  Bottom 0.203: v41.96,75.69 41.96,32.61 J4.9
TSOM_A1_SCL  (via drill 0.3)
  Top 0.203: v43.23,75.69 43.23,76.71 44.42,77.9 U2.6 44.42,80.06 44.42,80.59 44.42,80.64 40.99,84.07 39.48,84.07 J1.4 39.16,84.09
  Top 0.813: J4.10 J5.10
  Bottom 0.203: v43.23,75.69 42.77,75.23 42.77,34.34 J4.10
TSOM_A2_BUTTON
  Top 0.813: J4.11 J5.11
TSOM_A3_BATT_TEMP
  Top 0.813: J4.12 J5.12
TSOM_A4
  Top 0.813: J2.9 J3.9
TSOM_A5
  Top 0.813: J2.10 J3.10
TSOM_A6
  Top 0.813: J2.11 J3.11
TSOM_A7
  Top 0.813: J2.12 J3.12
TSOM_NFC2
  Top 0.813: J2.16 J3.16
TSOM_RX
  Top 0.813: J4.21 J5.21
TSOM_TX
  Top 0.813: J4.22 J5.22
TSOM_USB_N
  Top 0.813: J4.18 J5.18
TSOM_USB_P
  Top 0.813: J4.19 J5.19
TSOM_USB_VBUS
  Top 0.813: J4.3 J5.3
TSOM_VIN
  Top 0.813: J4.5 J5.5
VIN  (via drill 1.02 pad 1.91)
  Top 0.813: CN1.8 9.77,7.51 9.77,14.46 v9.75,14.48
  Top 1.524: J2.2 J3.2 6.64,10.83 6.66,10.82 | J2.1 J3.1 6.59,8.29 6.6,8.28
  pour Top (no thermals): 5.54,7.57 5.54,11.43 5.64,11.53 10.72,11.53 10.72,4.72 8.38,4.72

### Text on the board
tPlace: MONITOR ONE PROTO CARD v0.0.2 | RESET | MODE | SDA | SCL | 3V3 | !WP | GP | EXTI | NC | RBAT | NC | TX | NC | RX | NC | GND | NC | USB+ | NC | USB- | NC | GND | NFC2 | C5V | NFC1 | CAN+ | !MODE | CAN- | !RST | GND | A7 | A3 | A6 | A2 | A5 | A1 | A4 | A0 | GND | GND | 3V3 | VOUT | RUN | GND | PG | TVIN | GND | GND | GND | VIN | GND | 6 | 5 | 4 | 3 | 2 | 1 | A | B | C | D | VBUS | VIN | GND | VIN | LI+ | A | B | C | D